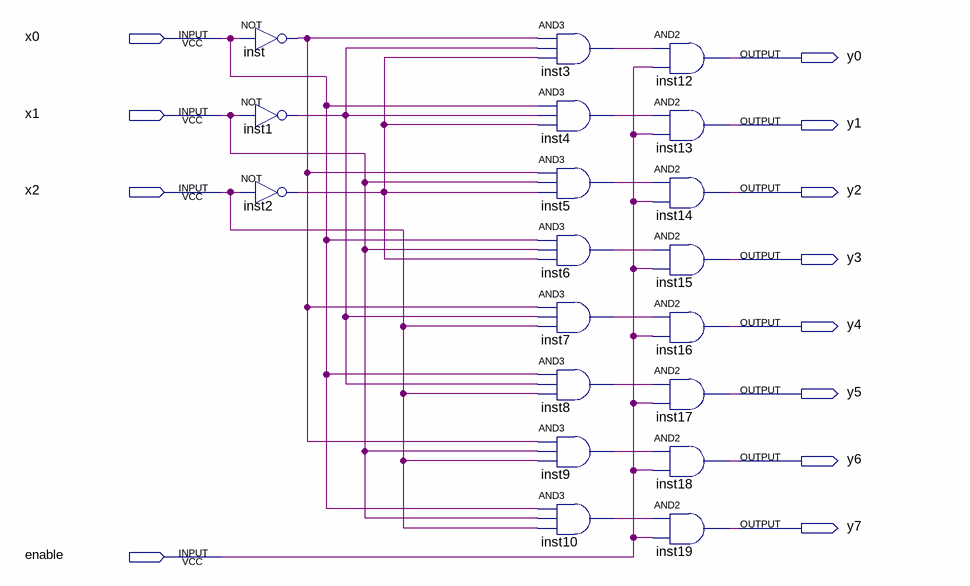
[diagram p0: schematic sheet]
// Quartus schematic LabProject1.bdf as structural Verilog: 19 symbols, 12 pins
module LabProject1 (
  input  x0,
  input  x1,
  input  x2,
  input  enable,
  output y0,
  output y1,
  output y2,
  output y3,
  output y4,
  output y5,
  output y6,
  output y7
);

  wire inst1_out, inst2_out, inst3_out, inst4_out, inst5_out, inst6_out, inst7_out, inst8_out, inst9_out,
       inst10_out, inst_out;

  not inst (inst_out, x0);
  not inst1 (inst1_out, x1);
  not inst2 (inst2_out, x2);
  and inst3 (inst3_out, inst_out, inst1_out, inst2_out);
  and inst4 (inst4_out, x0, inst1_out, inst2_out);
  and inst5 (inst5_out, inst_out, x1, inst2_out);
  and inst6 (inst6_out, x0, x1, inst2_out);
  and inst7 (inst7_out, inst_out, inst1_out, x2);
  and inst8 (inst8_out, x0, inst1_out, x2);
  and inst9 (inst9_out, inst_out, x1, x2);
  and inst10 (inst10_out, x0, x1, x2);
  and inst12 (y0, inst3_out, enable);
  and inst13 (y1, inst4_out, enable);
  and inst14 (y2, inst5_out, enable);
  and inst15 (y3, inst6_out, enable);
  and inst16 (y4, inst7_out, enable);
  and inst17 (y5, inst8_out, enable);
  and inst18 (y6, inst9_out, enable);
  and inst19 (y7, inst10_out, enable);
endmodule
